# Altium schematic sheet USB_OTG_HS.SchDoc: USB OTG HS PHY with micro A-B connector
size A4; Author: N.P; CompanyName: STMicroelectronics; Organization: MCD/APPLIS/LMS; DocumentNumber: 8; SheetNumber: 8; SheetTotal: 13; Project: STM32F723e-DISCO
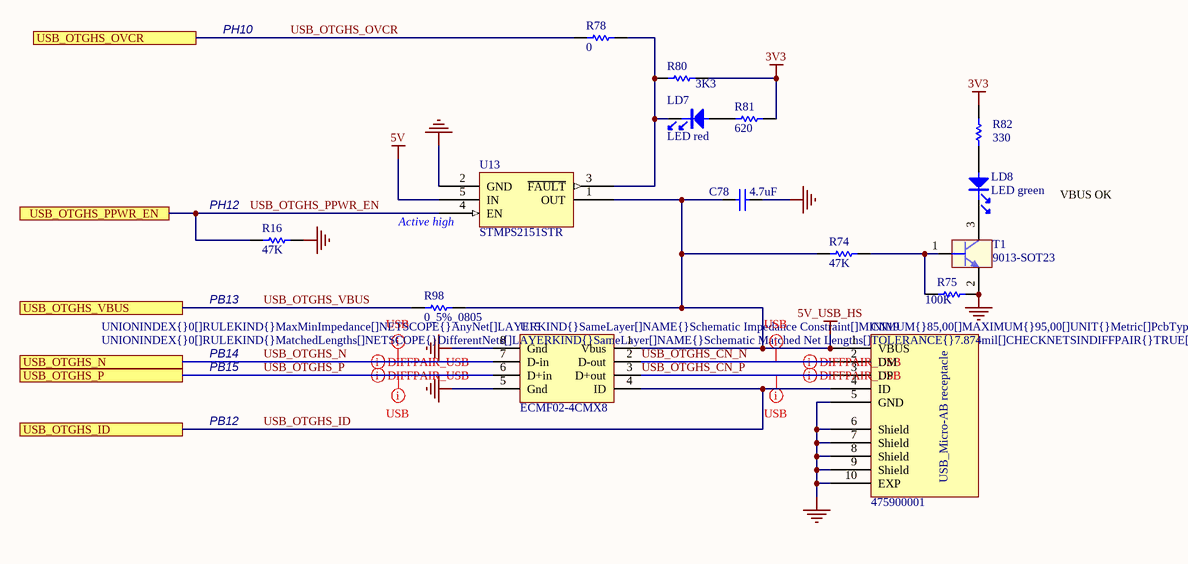
[diagram p0: USB_OTG_HS.SchDoc]

## Parts
C78  4.7uF  [0603C]
CN19  475900001  [MOLEX_47590001]
LD7  LED red  [0603D]
LD8  LED green  [0603D]
R16  value 47K  [0402R]  (hidden comment: 47K_1%_0402)
R74  value 47K  [0402R]  (hidden comment: 47K_1%_0402)
R75  value 100K  [0402R]  (hidden comment: 100K_1%_0402)
R78  0  [0402R]
R80  3K3  [0402R]
R81  value 620  [0603R]  (hidden comment: 620_1%_0603)
R82  value 330  [0603R]  (hidden comment: 330_1%_0603)
R98  0_5%_0805  [0805R]
T1  9013-SOT23  [SOT-23]
U13  STMPS2151STR  [SOT23-5]
U15  ECMF02-4CMX8  [QFN8_0R5_2R5X1R2]

## Ports
USB_OTGHS_ID, USB_OTGHS_N, USB_OTGHS_OVCR, USB_OTGHS_P, USB_OTGHS_PPWR_EN, USB_OTGHS_VBUS

## Nets
3V3: R80.1 R81.1 R82.2
5V: U13.5(IN)
5V_USB_HS: C78.1 CN19.1(VBUS) R74.2 R98.2 U13.1(OUT) U15.1(Vbus)
GND: C78.2 CN19.5(GND) CN19.6(Shield) CN19.7(Shield) CN19.8(Shield) CN19.9(Shield) CN19.10(EXP) R16.1 R75.2 T1.2(E) U13.2(GND) U15.5(Gnd) U15.8(Gnd)
USB_OTGHS_CN_N: CN19.2(DM) U15.2(D-out)
USB_OTGHS_CN_P: CN19.3(DP) U15.3(D+out)
USB_OTGHS_ID: CN19.4(ID) U15.4(ID) ; port USB_OTGHS_ID
USB_OTGHS_N: U15.7(D-in) ; port USB_OTGHS_N
USB_OTGHS_OVCR: R78.2 ; port USB_OTGHS_OVCR
USB_OTGHS_P: U15.6(D+in) ; port USB_OTGHS_P
USB_OTGHS_PPWR_EN: R16.2 U13.4(EN) ; port USB_OTGHS_PPWR_EN
USB_OTGHS_VBUS: R98.1 ; port USB_OTGHS_VBUS
NetLD7_1: LD7.1 R81.2
NetLD7_2: LD7.2 R78.1 R80.2 U13.3(~{FAULT})
NetLD8_1: LD8.1 R82.1
NetLD8_2: LD8.2 T1.3(C)
NetR74_1: R74.1 R75.1 T1.1(B)

## Layout directives
differential pair; rule Impedance Constraint [Min = 85.00    Max = 95.00    ]: USB_OTGHS_CN_N, USB_OTGHS_CN_P, USB_OTGHS_N, USB_OTGHS_P
rule Undefined; rule Matched Net Lengths [Tolerance = 0.2mm]; rule Impedance Constraint [Min = 85.00    Max = 95.00    ]: USB_OTGHS_CN_N, USB_OTGHS_CN_P, USB_OTGHS_N, USB_OTGHS_P

## Notes on the sheet
- PH10
- (near R16) PH12
- VBUS OK
- (near U13) Active high
- PB13
- PB14
- PB15
- PB12
- Title:
- Project:
- Size:
- Revision:
- Variant:
- A4
- -
- Date:
- Reference:
- Sheet:
- of
- (in symbol 475900001) USB_Micro-AB receptacle

## Library data of the parts
C78 = Cap_4.7uF_X5R_10%_0603: Capacitor,4.7uF,16V, X5R,10%,0603,YAGEO; Manuf_Part_1: CC0603KRX5R7BB475; Order: CC0603KRX5R7BB105; Ordered by: Subcon; Fitted: YES; Revision: July-2002: Re-released for DXP Platform.; Value: 4.7uF; Manuf_1: YAGEO; ECCN_US/EU: n/a
CN19 = 475900001: USB-MICRO-AB, 47590-0001, SMT, MOLEX; Ordered by: Subcon; Fitted: YES; Manuf_Part_1: 47590-0001; Manuf_1: MOLEX; ECCN_US/EU: n/a
LD7 = LED_red: LED red 0603; Manuf_1: everlight; Manuf_Part_1: 19-213-R6C-AP1Q2B/3T; Ordered by: Subcon; Fitted: YES; Order: 19-213-R6C-AP1Q2B/3T; ECCN_US/EU: n/a
LD8 = LED_green: LED green 0603; Manuf_1: everlight; Manuf_Part_1: 19-213SYGC/S530-E2/TR8; Ordered by: Subcon; Fitted: YES; Order: 19-213SYGC/S530-E2/TR8; ECCN_US/EU: n/a
R16 R74 = Res_47K_1%_0402: Resistor,47K,0402,1%,YAGEO; Manuf_Part_1: RC0402FR-0747KL; Order: 9239430; Ordered by: Subcon; Fitted: YES; Manuf_1: YAGEO; ECCN_US/EU: n/a; Distrib: FARNELL
R75 = Res_100K_1%_0402: Resistor,100K,0402,1%,YAGEO; Manuf_Part_1: RC0402FR-07100KL; Manuf_Part_2: RT0402FRE07100KL; Ordered by: Subcon; Fitted: YES; Manuf_1: YAGEO; ECCN_US/EU: n/a; Manuf_2: YAGEO
R78 = Res_0_5%_0402: Resistor,0,0402,5%,YAGEO; Manuf_Part_1: RC0402JR-070RL; Order: 2363467; Ordered by: Subcon; Fitted: YES; Value: 0; ECCN_US/EU: n/a; Manuf_1: YAGEO; Distrib: FARNELL
R80 = Res_3K3_1%_0402: Resistor,3K3,0402,1%,YAGEO; Manuf_Part_1: RC0402FR-073K3L; Ordered by: Subcon; Fitted: YES; Value: 3K3; Manuf_1: YAGEO; Order: *; ECCN_US/EU: n/a; Distrib: FARNELL
R81 = Res_620_1%_0603: Resistor,620,0603,1%,VISHAY; Manuf_Part_1: CRCW0603620RFKEA; Manuf_1: VISHAY DRALORIC; Order: 2122341; Ordered by: Subcon; Fitted: YES; ECCN_US/EU: n/a; Distrib: FARNELL
R82 = Res_330_1%_0603: Resistor,330,0603,1%,YAGEO; Manuf_Part_1: RC0603FR-07330RL; Manuf_Part_2: RT0603FRE07330RL; Ordered by: Subcon; Fitted: YES; ECCN_US/EU: n/a; Manuf_1: YAGEO; Distrib: FARNELL; Manuf_2: YAGEO
R98 = Res_0_5%_0805: Resistor,0,0805,5%,YAGEO; Manuf_Part_1: RC0805JR-070RL; Value: 0; Order: 2363489; Fitted: YES; Ordered by: Subcon; ECCN_US/EU: n/a; Manuf_1: YAGEO
T1 = 9013-SOT23: NPN Bipolar Transistor; Manuf_1: NXP; Manuf_Part_1: BSR14; Order: 1081310; Ordered by: Subcon; Fitted: YES; Revision: July-2002: Re-released for DXP Platform.; Distrib: FARNELL; ECCN_US/EU: n/a
U13 = STMPS2151STR: Enhanced single channel power switches; Manuf_1: STM; Provided: ST; ECCN_US/EU: EAR99/NEC; Fitted: YES; Order: STMPS2151STR; Manuf_Part_1: STMPS2151STR; Distrib: ST; Ordered by: ST
U15 = ECMF02-4CMX8: Common mode filter with ESD protection for USB 2.0 interface; Manuf_1: STM; Provided: ST; ECCN_US/EU: EAR99/NEC; Fitted: YES; Order: ECMF02-4CMX8; Manuf_Part_1: ECMF02-4CMX8; Distrib: ST; Ordered by: ST